# Altium schematic sheet 5V Regulator.SchDoc: 5V Regulator
size Tabloid; Date: 1/20/2016; ApprovedBy: NA; CompanyName: Cospan Design LLC; DrawnBy: David McCoy; Engineer: David McCoy; DocumentNumber: 16; SheetNumber: 16; SheetTotal: 18; Client: OSH; ProjectPrettyName: Guppy Buddy; Project: Guppy Buddy; ProjectName: Edenis: TX Adapter
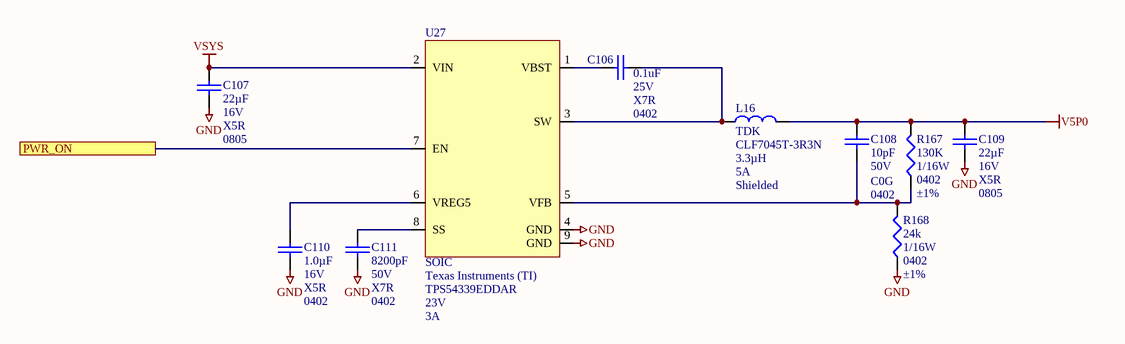
[diagram p0: 5V Regulator.SchDoc]

## Parts
C106  Capacitance: 0.1uF  Voltage - Rated: 25V  Temperature Coefficient: X7R  Package / Case: 0402  [C_0402]  (hidden comment: C_0402_0.1UF_25V)
C107  Voltage - Rated: 16V  Temperature Coefficient: X5R  Package / Case: 0805  [C_0805]  (hidden comment: 22µF)
C108  Voltage - Rated: 50V  Temperature Coefficient: C0G  Package / Case: 0402  [C_0402]  (hidden comment: 10pF)
C109  Voltage - Rated: 16V  Temperature Coefficient: X5R  Package / Case: 0805  [C_0805]  (hidden comment: 22µF)
C110  Capacitance: 1.0µF  Voltage - Rated: 16V  Temperature Coefficient: X5R  Package / Case: 0402  [C_0402]  (hidden comment: 1.0uF)
C111  Capacitance: 8200pF  Voltage - Rated: 50V  Temperature Coefficient: X7R  Package / Case: 0402  [C_ERA-0402]  (hidden comment: C_0402_8.2NF)
L16  Manufacturer: TDK  Manufacturer Part Number: CLF7045T-3R3N  Inductance: 3.3µH  Current Rating: 5A  Shielding: Shielded  [CLF7045]  (hidden comment: L_CLF7045T-3R3N)
R167  Resistance In Ohms: 130K  Power (Watts): 1/16W  Case: 0402  Tolerance: ±1%  [R_0402]  (hidden comment: R_0402_130K)
R168  Resistance In Ohms: 24k  Power (Watts): 1/16W  Case: 0402  Tolerance: ±1%  [R_0402]  (hidden comment: R_0402_24k)
U27  Case/Package: SOIC  Manufacturer: Texas Instruments (TI)  Manufacturer Part Number: TPS54339EDDAR  Max Input Voltage: 23V  Output Current: 3A  [DDA0008E]  (hidden comment: U_TPS54339EDDAR)

## Ports
PWR_ON

## Nets
GND: C107.1 C109.1 C110.1 C111.1 R168.2 U27.4(GND) U27.9(GND)
V5P0: C108.2 C109.2 L16.1 R167.1
VSYS: C107.2 U27.2(VIN)
PWR_ON: U27.7(EN) ; port PWR_ON
NetC106_1: C106.1 L16.2 U27.3(SW)
NetC106_2: C106.2 U27.1(VBST)
NetC108_1: C108.1 R167.2 R168.1 U27.5(VFB)
NetC110_2: C110.2 U27.6(VREG5)
NetC111_2: C111.2 U27.8(SS)

## Notes on the sheet
- Project:
- http://www.cospandesign.com
- Cospan Design
- Document:
- Engineer:
- Title:
- Client:
- Approved By:
- Revision:
- Date:
- Number:
- of

## Library data of the parts
C106 = C_0402_0.1UF_25V: CAP CER 0.1UF 25V X6S 0402; Manufacturer 1: Yageo; Manufacturer Part Number 1: CC0402KRX7R8BB104; Description 1: Cap Ceramic 0.1uF 25V X7R 10% SMD 0402 125C Paper T/R; Tolerance: 10%; Dissipation Factor: 3.5%; ComponentLink1URL: https://product.tdk.com/info/en/catalog/datasheets/mlcc_commercial_general_en.pdf; ComponentLink1Description: https://product.tdk.com/info/en/catalog/datasheets/mlcc_commercial_general_en.pdf; Supplier 1: Digi-Key; Supplier Part Number 1: 311-2077-1-ND; Stock 1: 0; Pricing 1: 1=0.1, 10=0.048, 100=0.0215, 500=0.01534, 1000=0.01205, 2500=0.01095, 5000=0.01007 (USD); Mount: Surface Mount; Case/Package: 0402; Case Code (Imperial): 0402; Case Code (Metric): 1005; Min Operating Temperature: -55°C; Max Operating Temperature: 125°C; Voltage Rating: 25V; Voltage Rating (DC): 25V; Packaging: Tape and Reel; Dielectric: X7R; Termination: SMD/SMT; Composition: Ceramic; Length: 1mm; Height: 0.5mm; Width: 0.02inch; Thickness: 0.022inch; Depth: 0.5mm; Radiation Hardening: No; Lead Free: Lead Free; Halogen Free: Halogen Free; ComponentLink2URL: https://datasheet.ciiva.com/11464/upy-gphc-x7r-6-3v-to-50v-8-11464889.pdf; ComponentLink2Description: https://datasheet.ciiva.com/11464/upy-gphc-x7r-6-3v-to-50v-8-11464889.pdf; ComponentLink3URL: https://datasheet.ciiva.com/13210/upy-gphc-x7r-6-3v-to-50v-8-12304-13210908.pdf; ComponentLink3Description: https://datasheet.ciiva.com/13210/upy-gphc-x7r-6-3v-to-50v-8-12304-13210908.pdf; ComponentLink4URL: https://datasheet.ciiva.com/17437/upy-gphc-x7r-6-3v-to-50v-8-17437357.pdf; ComponentLink4Description: https://datasheet.ciiva.com/17437/upy-gphc-x7r-6-3v-to-50v-8-17437357.pdf
C107 C109 = C_0805_22µF_16V: CAP CER 22UF 16V 10% X5R 0805; Manufacturer 1: Samsung; Manufacturer Part Number 1: CL21A226MOCLRNC; Description 1: 22µF 16V Ceramic Capacitor X5R 0805 (2012 Metric) 0.079" L x 0.049" W (2.00mm x 1.25mm); Tolerance: 20%; ComponentLink1URL: http://product.tdk.com/capacitor/mlcc/en/documents/mlcc_commercial_general_en.pdf; ComponentLink1Description: http://product.tdk.com/capacitor/mlcc/en/documents/mlcc_commercial_general_en.pdf; Supplier 1: Digi-Key; Supplier Part Number 1: 1276-6780-6-ND; Stock 1: 40000; Pricing 1: 1=0.33, 10=0.227, 100=0.1288, 500=0.09094, 1000=0.07956 (USD); Mount: Surface Mount; Case/Package: 0805; Case Code (Metric): 2012; Case Code (Imperial): 0805; Min Operating Temperature: -55°C; Max Operating Temperature: 85°C; Packaging: Tape and Reel; Voltage Rating: 16V; Length: 0.079inch; Width: 0.049inch; Thickness: 0.037inch; ComponentLink2URL: http://www.samsungsem.com/kr/support/product-search/mlcc/CL21A226MOCLRNC.jsp; ComponentLink2Description: http://www.samsungsem.com/kr/support/product-search/mlcc/CL21A226MOCLRNC.jsp; Capacitance: 22µF
C108 = C_0402_10PF_50V: CAP CER 10PF 50V NP0 0402; Manufacturer: Taiyo Yuden; Manufacturer Part Number: UMK105CG100DV-F; Tolerance: .5pF; Supplier 1: Digi-Key; Supplier Part Number 1: 587-1947-1-ND; RoHS: RoHS Compliant; Category: Capacitors; Stock 1: 47289; Pricing: 1=0.07, 10=0.045, 50=0.0216, 100=0.0162, 250=0.01172, 500=0.00864, 1000=0.00585, 5000=0.0045 (USD); Mounting Type: Surface Mount, MLCC; Operating Temperature: -55°C ~ 125°C; Applications: General Purpose; Ratings: -; Size / Dimension: 0.039" L x 0.020" W (1.00mm x 0.50mm); Height - Seated (Max): -; Thickness (Max): 0.022" (0.55mm); Lead Spacing: -; Features: -; Packaging: Cut Tape (CT); Lead Style: -; ComponentLink1URL: http://www.yuden.co.jp/productdata/catalog/en/mlcc02_e.pdf; ComponentLink1Description: http://www.yuden.co.jp/productdata/catalog/en/mlcc02_e.pdf; Capacitance: 10pF
C110 = C_0402_1.0UF_16V: CAP CER 1.0UF 16V X5R 0402; Manufacturer 1: Samsung; Manufacturer Part Number 1: CL05A105KO5NNNC; Tolerance: 10%; Description 1: Cap Ceramic 1uF 16V X5R 10% SMD 0402 85C Paper T/R; Supplier 1: Digi-Key; Stock 1: 26908; Pricing 1: 1=0.1, 10=0.062, 100=0.0276, 500=0.01968, 1000=0.01547, 2500=0.01406, 5000=0.01294 (USD); Packaging: Tape and Reel; ComponentLink1URL: http://ds.yuden.co.jp/TYCOMPAS/ut/detail.do?productNo=EMK105BJ105KV-F&fileName=EMK105BJ105KV-F_SS&mode=specSheetDownload; ComponentLink1Description: http://ds.yuden.co.jp/TYCOMPAS/ut/detail.do?productNo=EMK105BJ105KV-F&fileName=EMK105BJ105KV-F_SS&mode=specSheetDownload; Supplier Part Number 1: 1276-1067-6-ND; ComponentLink2URL: https://datasheet.ciiva.com/16207/cl05a105ko5nnnc-16207571.pdf; ComponentLink2Description: https://datasheet.ciiva.com/16207/cl05a105ko5nnnc-16207571.pdf; ComponentLink3URL: https://datasheet.ciiva.com/15195/getdatasheetpartid-355272-15195629.pdf; ComponentLink3Description: https://datasheet.ciiva.com/15195/getdatasheetpartid-355272-15195629.pdf; Mount: Surface Mount; Case/Package: 0402; Case Code (Metric): 1005; Case Code (Imperial): 0402; Contact Plating: Tin; Min Operating Temperature: -55°C; Max Operating Temperature: 85°C; Dielectric: X5R; Package Quantity: 1; Voltage Rating: 16V; Voltage: 16V; Length: 1mm; Height: 0.5mm; Width: 0.02inch; Thickness: 0.022inch; Depth: 0.5mm; Radiation Hardening: No
C111 = C_0402_8.2NF: CAP CER 8200PF 50V X7R 0402; Manufacturer 1: Samsung; Manufacturer Part Number 1: CL05B822KB5NNNC; Tolerance: 10%; Description 1: Cap Ceramic 0.0082uF 50V X7R 10% SMD 0402 125C T/R; Material: Ceramic; Supplier 1: Digi-Key; Stock 1: 102323; Pricing 1: 1=0.1, 10=0.037, 100=0.0164, 500=0.01168, 1000=0.00918, 2500=0.00834, 5000=0.00768 (USD); Packaging: Tape and Reel; ComponentLink1URL: http://www.murata.com/~/media/webrenewal/support/library/catalog/products/capacitor/mlcc/c02e.ashx; ComponentLink1Description: http://www.murata.com/~/media/webrenewal/support/library/catalog/products/capacitor/mlcc/c02e.ashx; Supplier Part Number 1: 1276-1591-6-ND; Mount: Surface Mount; Case/Package: 0402; Case Code (Metric): 1005; Case Code (Imperial): 0402; Min Operating Temperature: -55°C; Max Operating Temperature: 125°C; Package Quantity: 1; Voltage Rating: 50V; Dielectric: X7R; Voltage: 50V; Voltage Rating (DC): 50V; Length: 1mm; Height: 0.5mm; Width: 0.02inch; Thickness: 0.022inch; Depth: 0.5mm; Radiation Hardening: No; Lead Free: Lead Free; ComponentLink2URL: https://datasheet.ciiva.com/16207/cl05b104kq5nnnc-16207576.pdf; ComponentLink2Description: https://datasheet.ciiva.com/16207/cl05b104kq5nnnc-16207576.pdf; ComponentLink3URL: https://datasheet.ciiva.com/15195/getdatasheetpartid-464695-15195658.pdf; ComponentLink3Description: https://datasheet.ciiva.com/15195/getdatasheetpartid-464695-15195658.pdf; ComponentLink4URL: https://datasheet.ciiva.com/29198/458804-da-01-en-vs-kondensator-0402-29198438.pdf; ComponentLink4Description: https://datasheet.ciiva.com/29198/458804-da-01-en-vs-kondensator-0402-29198438.pdf
L16 = L_CLF7045T-3R3N: FIXED IND 15UH 1.9A 95.8 MOHM; Type: Wirewound; Material - Core: Ferrite; Tolerance: ±30%; DC Resistance (DCR): 21.32 mOhm Max; Supplier 1: Digi-Key; RoHS: RoHS Compliant; Category: Inductors, Coils, Chokes; Stock 1: 4747; Pricing 1: 1=1.43, 10=1.332, 100=0.9632, 500=0.73774 (USD); Packaging: Cut Tape (CT); Part Status: Active; Q @ Freq: -; Ratings: AEC-Q200; Operating Temperature: -40°C ~ 150°C; Mounting Type: Surface Mount; Package / Case: Nonstandard; Size / Dimension: 0.283" L x 0.272" W (7.20mm x 6.90mm); Height - Seated (Max): 0.177" (4.50mm); ComponentLink1URL: https://product.tdk.com/info/en/documents/catalog/inductor_automotive_power_clf7045-d_en.pdf; ComponentLink1Description: https://product.tdk.com/info/en/documents/catalog/inductor_automotive_power_clf7045-d_en.pdf; Supplier Part Number 1: 445-9554-1-ND
R167 = R_0402_130K: RES 130K OHM 1/10W 1% 0402 SMD; Manufacturer: Panasonic Electronic Components; Manufacturer Part Number: ERJ-2RKF1303X; Temperature Coefficient: ±100ppm/°C; Supplier 1: Digi-Key; Supplier Part Number 1: P130KLCT-ND; RoHS: RoHS Compliant; Category: Resistors; Stock 1: 388696; Pricing: 1=0.1, 50=0.0242, 100=0.0184, 250=0.01364, 500=0.01008, 1000=0.00672, 5000=0.00473 (USD); Resistance (Ohms): 130k; Composition: Thick Film; Features: -; Package / Case: 0402 (1005 Metric); Supplier Device Package: 0402; Size / Dimension: 0.039" L x 0.020" W (1.00mm x 0.50mm); Height: 0.016" (0.40mm); Number of Terminations: 2; Packaging: Cut Tape (CT); ComponentLink1URL: http://industrial.panasonic.com/www-cgi/jvcr13pz.cgi?E+PZ+3+AOA0002+ERJ2RKF1303X+7+WW; ComponentLink1Description: http://industrial.panasonic.com/www-cgi/jvcr13pz.cgi?E+PZ+3+AOA0002+ERJ2RKF1303X+7+WW
R168 = R_0402_24k: RES SMD 24K OHM 1% 1/16W 0402; Manufacturer: Yageo; Manufacturer Part Number: RC0402FR-0724KL; Temperature Coefficient: ±100ppm/°C; Supplier 1: Digi-Key; RoHS: RoHS Compliant; Category: Resistors; Stock 1: 267958; Pricing 1: 1=0.1, 10=0.014, 100=0.0056, 1000=0.00253, 2500=0.0022, 5000=0.00181 (USD); Packaging: Cut Tape (CT); Part Status: Active; Resistance (Ohms): 24k; Composition: Thick Film; Features: Moisture Resistant; Operating Temperature: -55°C ~ 155°C; Package / Case: 0402 (1005 Metric); Supplier Device Package: 0402; Size / Dimension: 0.039" L x 0.020" W (1.00mm x 0.50mm); Height - Seated (Max): 0.016" (0.40mm); Failure Rate: -; ComponentLink1URL: http://www.yageo.com/documents/recent/PYu-RC_Group_51_RoHS_L_7.pdf; ComponentLink1Description: http://www.yageo.com/documents/recent/PYu-RC_Group_51_RoHS_L_7.pdf; Supplier Part Number 1: 311-24KLRCT-ND
U27 = U_TPS54339EDDAR: IC REG BUCK SYNC ADJ 3A 8SOPWR; Min Supply Voltage: 4.5V; Number of Outputs: 1; Output Voltage: 7V; Max Output Current: 10A; Switching Frequency: 600KHz; Min Output Voltage: 760mV; Synchronous Rectifier: Yes; Quiescent Current: 600uA; Supplier 1: Digikey; Stock 1: 1978; Pricing 1: 1=1.91, 10=1.72, 100=1.3822, 500=1.1356, 1000=0.9409 (USD); Mount: Surface Mount; Number of Pins: 8; Contact Plating: Gold; Min Operating Temperature: -40°C; Max Operating Temperature: 85°C; Min Input Voltage: 4.5V; Package Quantity: 2500; Packaging: Tape and Reel; Max Output Voltage: 7V; Lead Free: Lead Free; ComponentLink1URL: http://www.ti.com/litv/slvsbm0a; ComponentLink1Description: http://www.ti.com/litv/slvsbm0a; ComponentLink2URL: http://www.ti.com/general/docs/lit/getliterature.tsp?genericPartNumber=TPS54339E&&fileType=pdf; ComponentLink2Description: http://www.ti.com/general/docs/lit/getliterature.tsp?genericPartNumber=TPS54339E&&fileType=pdf; ComponentLink3URL: http://www.ti.com/lit/ds/symlink/tps54339e.pdf; ComponentLink3Description: http://www.ti.com/lit/ds/symlink/tps54339e.pdf; Supplier Part Number 1: 296-40793-1-ND